# EAGLE design Soil Moisture sensor(only soil)modif_usb_oriz (EAGLE 9.6.2)

## Sheet 1 of 2
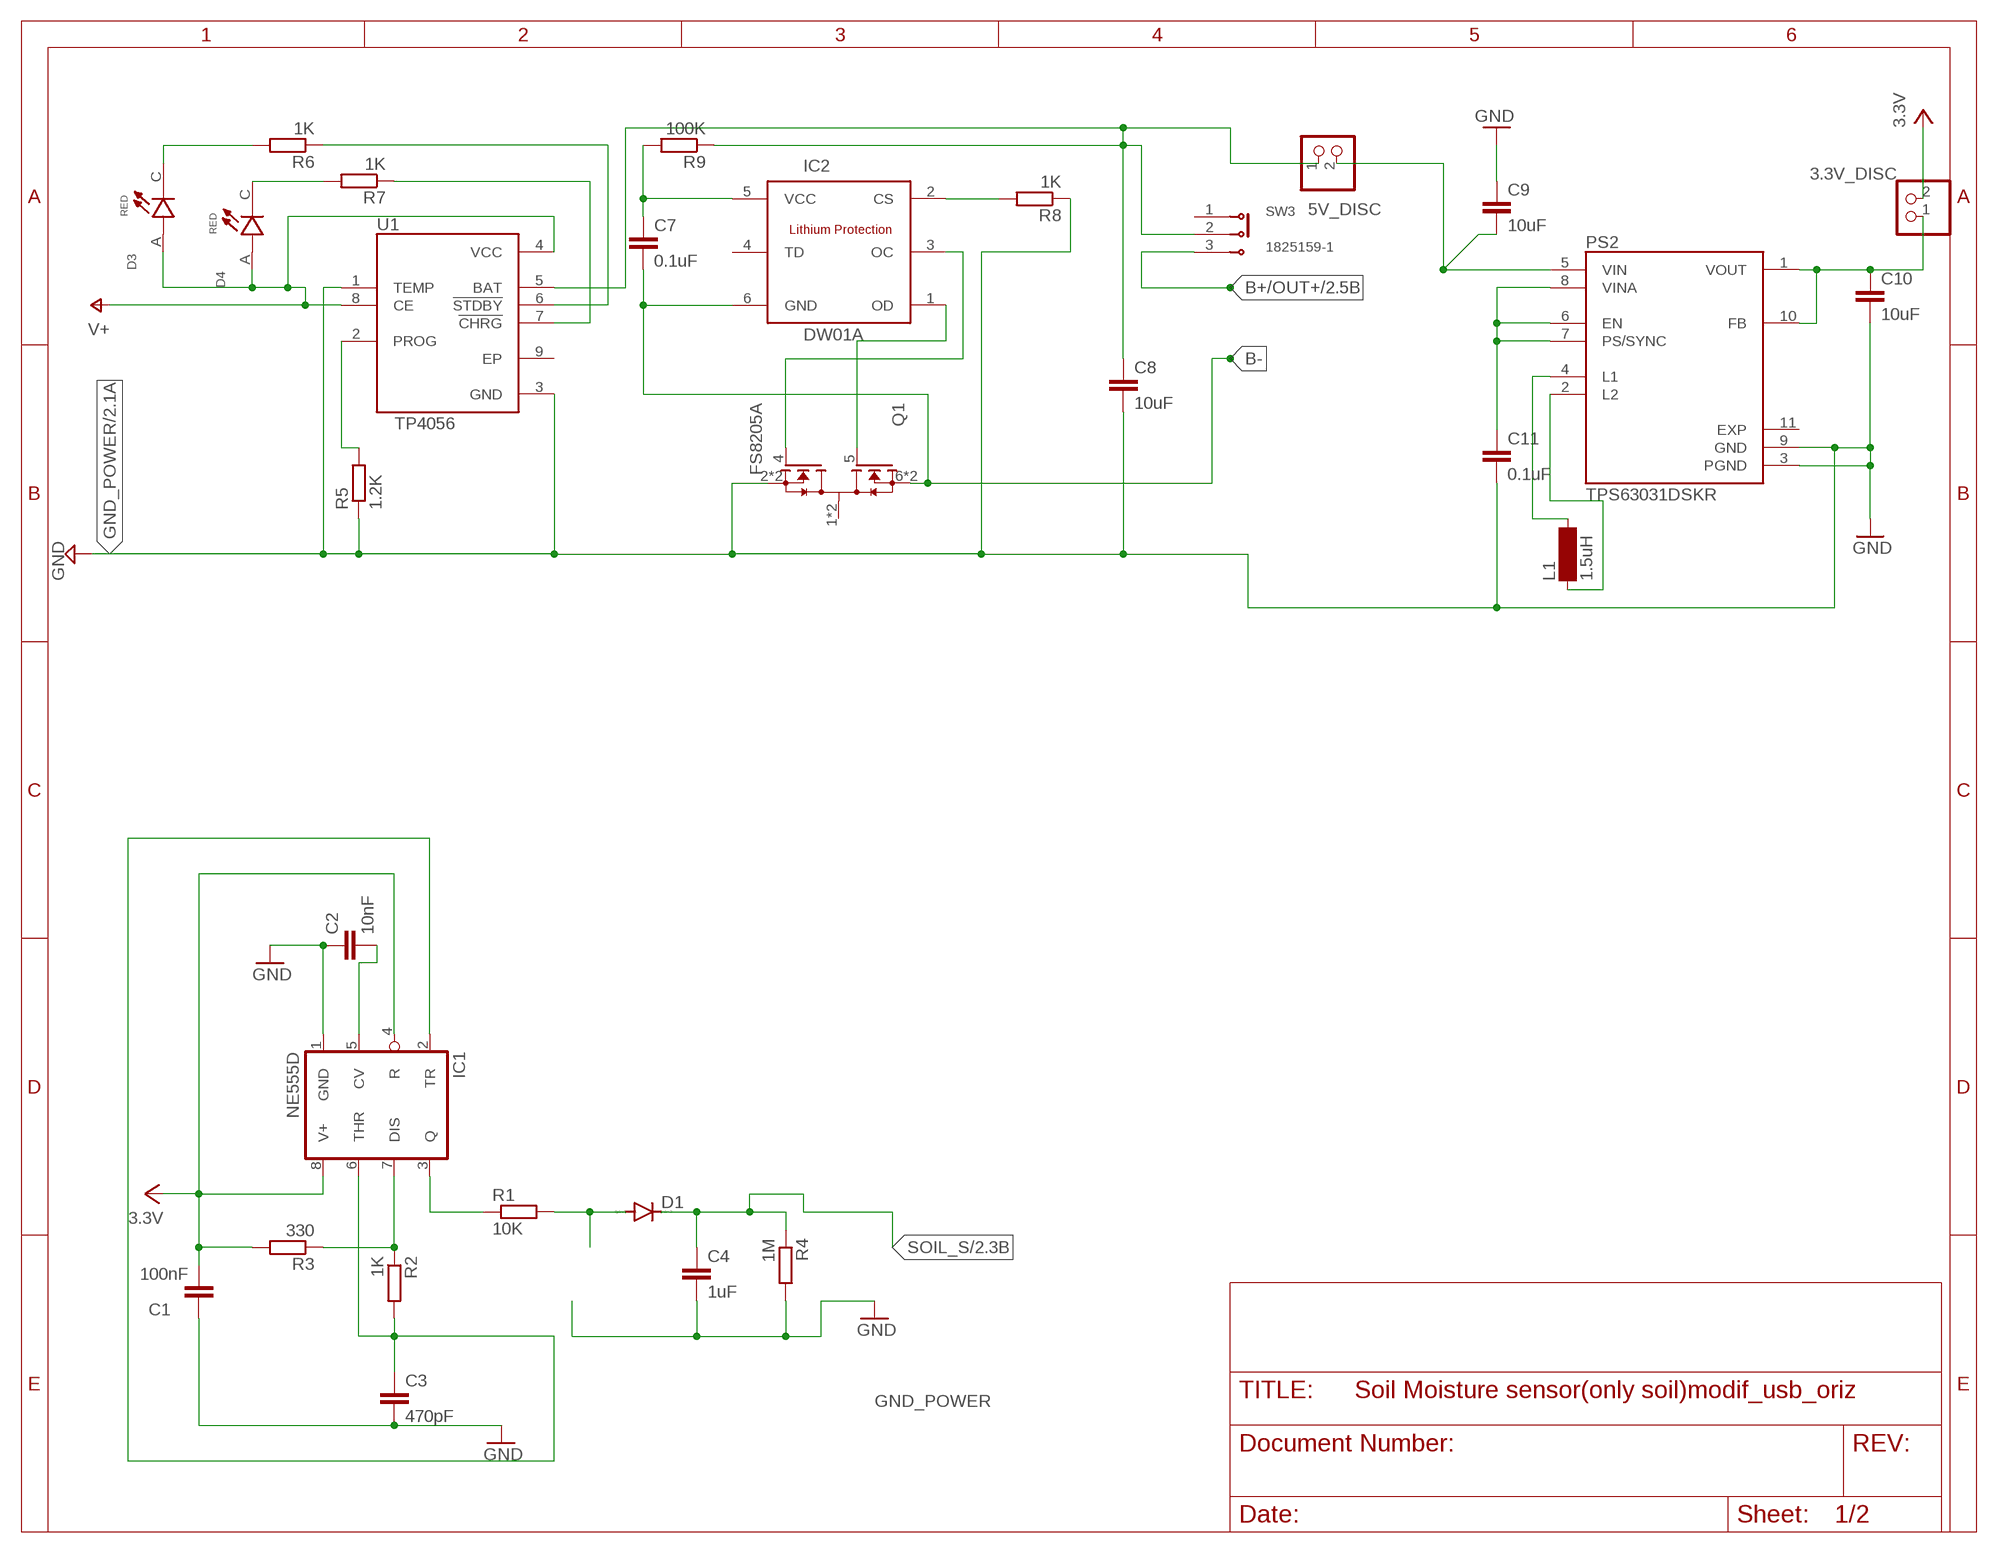
[diagram p0: schematic, sheet 1]

### Parts
3.3V_DISC  PINHD-1X2  [1X02]
5V_DISC  PINHD-1X2  [1X02]
C1  100nF  C-EUC0805  [C0805]
C2  10nF  C-EUC0805  [C0805]
C3  470pF  C-EUC0805  [C0805]
C4  1uF  C-EUC0805  [C0805]
C7  0.1uF  C-EUC0805  [C0805]
C8  10uF  C-EUC0805  [C0805]
C9  10uF  C-EUC0805  [C0805]
C10  10uF  C-EUC0805  [C0805]
C11  0.1uF  C-EUC0805  [C0805]
D1  DIODE-MINIMELF  [MINIMELF]
D3  7012X1  [LED_7012X1]
D4  7012X1  [LED_7012X1]
IC1  NE555D  [SO08]
IC2  DW01A  [SOT23-6]
L1  1.5uH  MS50  [MS50]
PS2  TPS63031DSKR  [SON50P250X250X80-11N]
Q1  FS8205A  [SOP65P640X120-8N]
R1  10K  R-EU_R0805  [R0805]
R2  1K  R-EU_R0805  [R0805]
R3  330  R-EU_R0805  [R0805]
R4  1M  R-EU_R0805  [R0805]
R5  1.2K  R-EU_R0805  [R0805]
R6  1K  R-EU_R0805  [R0805]
R7  1K  R-EU_R0805  [R0805]
R8  1K  R-EU_R0805  [R0805]
R9  100K  R-EU_R0805  [R0805]
SW3  1825159-1  [SW_1825159-1]
U1  TP4056  [SOP127P600X175-9N]

### Nets
B+/OUT+: 5V_DISC.1 C8.1 R9.1 SW3.2 SW3.3 U1.5(BAT) ; also sheet 2
B-: C7.2 IC2.6(GND) Q1.6(S2) Q1.7(S2)
GND_POWER: C1.1 C2.1 C3.2 C4.2 C8.2 C9.1 C10.2 C11.2 IC1.1(GND) PS2.3(PGND) PS2.9(GND) Q1.2(S1) Q1.3(S1) R4.2 R5.1 R8.1 U1.1(TEMP) U1.3(GND) ; supply symbol labelled GND ; also sheet 2
N$1: IC1.7(DIS) R2.1 R3.1
N$2: C2.2 IC1.5(CV)
N$3: C3.1 IC1.2(TR) IC1.6(THR) R2.2
N$4: IC1.3(Q) R1.1
N$5: R7.1 U1.7(!CHRG)
N$6: R6.1 U1.6(!STDBY)
N$7: R5.2 U1.2(PROG)
N$8: D3.C R6.2
N$9: D4.C R7.2
N$10: IC2.1(OD) Q1.5(G2)
N$11: IC2.3(OC) Q1.4(G1)
N$12: IC2.2(CS) R8.2
N$13: C7.1 IC2.5(VCC) R9.2
N$15: C11.1 PS2.6(EN) PS2.7(PS/SYNC) PS2.8(VINA)
N$17: L1.1 PS2.2(L2)
N$18: L1.2 PS2.4(L1)
N$26: 5V_DISC.2 C9.2 PS2.5(VIN)
N$34: 3.3V_DISC.1 C10.1 PS2.1(VOUT) PS2.10(FB)
N$35: D1.A R1.2
SOIL_S: C4.1 D1.C R4.1 ; also sheet 2
V+: D3.A D4.A U1.4(VCC) U1.8(CE) ; also sheet 2
VCC: 3.3V_DISC.2 C1.2 IC1.4(R) IC1.8(V+) R3.2 ; supply symbol labelled 3.3V ; also sheet 2
Unconnected: IC2.4(TD) PS2.11(EXP) Q1.1(D12) Q1.8(D12) SW3.1 U1.9(EP)

## Sheet 2 of 2
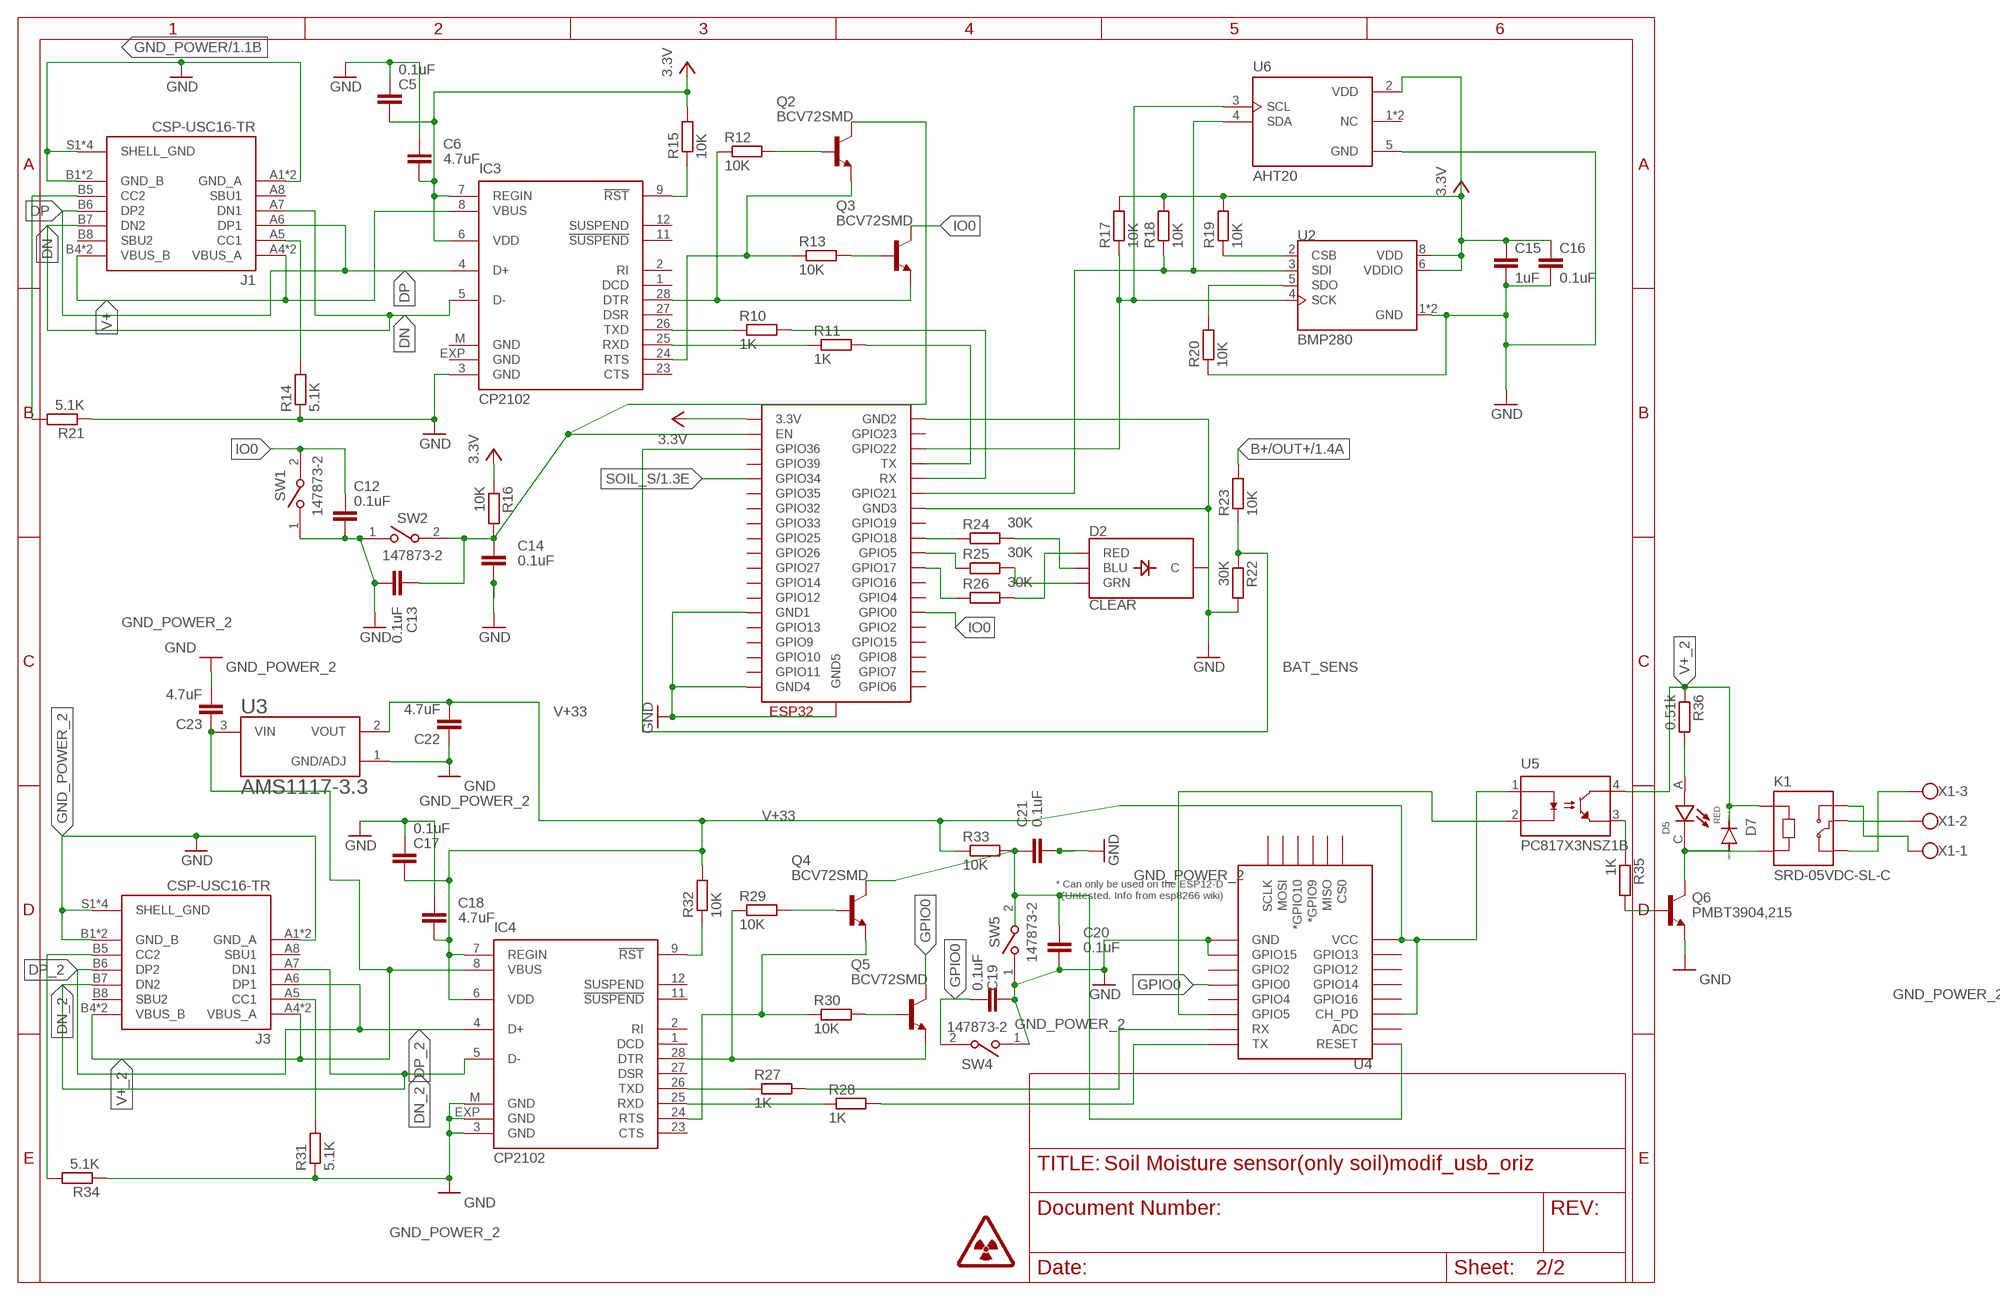
[diagram p1: schematic, sheet 2]

### Parts
C5  0.1uF  C-EUC0805  [C0805]
C6  4.7uF  C-EUC0805  [C0805]
C12  0.1uF  C-EUC0805  [C0805]
C13  0.1uF  C-EUC0805  [C0805]
C14  0.1uF  C-EUC0805  [C0805]
C15  1uF  C-EUC0805  [C0805]
C16  0.1uF  C-EUC0805  [C0805]
C17  0.1uF  C-EUC0805  [C0805]
C18  4.7uF  C-EUC0805  [C0805]
C19  0.1uF  C-EUC0805  [C0805]
C20  0.1uF  C-EUC0805  [C0805]
C21  0.1uF  C-EUC0805  [C0805]
C22  4.7uF  C-EUC0805  [C0805]
C23  4.7uF  C-EUC0805  [C0805]
D2  CLEAR  LED-RGB-CCCLEAR  [LED-RGB-THRU]
D5  7012X1  [LED_7012X1]
D7  DIODE-MINIMELF  [MINIMELF]
IC3  CP2102  [MLP28]
IC4  CP2102  [MLP28]
J1  CSP-USC16-TR  [VALCON_CSP-USC16-TR]
J3  CSP-USC16-TR  [VALCON_CSP-USC16-TR]
K1  SRD-05VDC-SL-C  [RELAY_SRD-05VDC-SL-C]
Q2  BCV72SMD  [SOT23-BEC]
Q3  BCV72SMD  [SOT23-BEC]
Q4  BCV72SMD  [SOT23-BEC]
Q5  BCV72SMD  [SOT23-BEC]
Q6  PMBT3904,215  [TRANS_PMBT3904,215]
R10  1K  R-EU_R0805  [R0805]
R11  1K  R-EU_R0805  [R0805]
R12  10K  R-EU_R0805  [R0805]
R13  10K  R-EU_R0805  [R0805]
R14  5.1K  R-EU_R0805  [R0805]
R15  10K  R-EU_R0805  [R0805]
R16  10K  R-EU_R0805  [R0805]
R17  10K  R-EU_R0805  [R0805]
R18  10K  R-EU_R0805  [R0805]
R19  10K  R-EU_R0805  [R0805]
R20  10K  R-EU_R0805  [R0805]
R21  5.1K  R-EU_R0805  [R0805]
R22  30K  R-EU_R0805  [R0805]
R23  10K  R-EU_R0805  [R0805]
R24  30K  R-EU_R0805  [R0805]
R25  30K  R-EU_R0805  [R0805]
R26  30K  R-EU_R0805  [R0805]
R27  1K  R-EU_R0805  [R0805]
R28  1K  R-EU_R0805  [R0805]
R29  10K  R-EU_R0805  [R0805]
R30  10K  R-EU_R0805  [R0805]
R31  5.1K  R-EU_R0805  [R0805]
R32  10K  R-EU_R0805  [R0805]
R33  10K  R-EU_R0805  [R0805]
R34  5.1K  R-EU_R0805  [R0805]
R35  1K  R-EU_R0805  [R0805]
R36  0.51k  R-EU_R0805  [R0805]
SW1  147873-2  [SW_147873-2]
SW2  147873-2  [SW_147873-2]
SW4  147873-2  [SW_147873-2]
SW5  147873-2  [SW_147873-2]
U2  BMP280  [XDCR_BMP280]
U3  AMS1117-3.3  [SOT229P700X180-4N]
U4  ESP12ESMD  [ESP12E-SMD]
U5  PC817X3NSZ1B  [DIP762W50P254L495H455Q4]
U6  AHT20  [PSON100P300X300X110-6N]
U$1  ESP32-WROOM  [ESP32-WROOM]
X1  W237-103  [W237-103]

### Nets
B+/OUT+: R23.2 ; also sheet 1
BAT_SENS: R22.1 R23.1 U$1.SENSOR_VP(GPIO36)
DN: IC3.5(D-) J1.A7(DN1) J1.B7(DN2)
DN_2: IC4.5(D-) J3.A7(DN1) J3.B7(DN2)
DP: IC3.4(D+) J1.A6(DP1) J1.B6(DP2)
DP_2: IC4.4(D+) J3.A6(DP1) J3.B6(DP2)
GND_POWER: C5.1 C6.1 C12.2 C13.2 C14.2 C15.2 C16.2 D2.2(C) IC3.3(GND) J1.A1(GND_A) J1.A12(GND_A) J1.B1(GND_B) J1.B12(GND_B) J1.S1(SHELL_GND) J1.S2(SHELL_GND) J1.S3(SHELL_GND) J1.S4(SHELL_GND) R14.1 R20.1 R21.1 R22.2 SW1.1 SW2.1 U2.1(GND) U2.7(GND) U6.5(GND) U$1.GND1 U$1.GND2 U$1.GND3 U$1.GND4 U$1.GND5 ; supply symbol labelled GND ; also sheet 1
GND_POWER_2: C17.1 C18.1 C19.2 C20.2 C21.2 C22.1 C23.2 IC4.3(GND) IC4.EXP(GND) IC4.M(GND) J3.A1(GND_A) J3.A12(GND_A) J3.B1(GND_B) J3.B12(GND_B) J3.S1(SHELL_GND) J3.S2(SHELL_GND) J3.S3(SHELL_GND) J3.S4(SHELL_GND) Q6.2(E) R31.1 R34.1 SW4.1 SW5.1 U3.1(GND/ADJ) U4.GND U4.GPIO15 ; supply symbol labelled GND
GPIO0: C19.1 Q5.C SW4.2 U4.GPIO0
IO0: C12.1 Q3.C SW1.2 U$1.IO0(GPIO0)
N$14: IC3.26(TXD) R10.1
N$16: R10.2 U$1.RX
N$19: IC3.25(RXD) R11.1
N$20: R11.2 U$1.TX
N$21: Q3.B R13.2
N$22: Q2.B R12.2
N$23: IC3.28(DTR) Q3.E R12.1
N$24: IC3.24(RTS) Q2.E R13.1
N$25: J1.A5(CC1) R14.2
N$27: C13.1 C14.1 Q2.C R16.2 SW2.2 U$1.EN
N$28: IC4.26(TXD) R27.1
N$29: R24.1 U$1.IO18(GPIO18)
N$30: IC3.9(!RST) R15.1
N$31: D2.4(BLU) R24.2
N$33: D2.1(RED) R26.2
N$36: J1.B5(CC2) R21.2
N$37: R19.1 U2.2(CSB)
N$38: R18.1 U2.3(SDI) U6.4(SDA) U$1.IO21(GPIO21)
N$39: R17.1 U2.4(SCK) U6.3(SCL) U$1.IO22(GPIO22)
N$40: R20.2 U2.5(SDO)
N$41: R27.2 U4.RXD0(RX)
N$42: IC4.25(RXD) R28.1
N$43: R28.2 U4.TXD0(TX)
N$44: Q5.B R30.2
N$45: R25.1 U$1.IO5(GPIO5)
N$46: R26.1 U$1.IO17(GPIO17)
N$47: D2.3(GRN) R25.2
N$48: Q4.B R29.2
N$49: IC4.28(DTR) Q5.E R29.1
N$50: IC4.24(RTS) Q4.E R30.1
N$51: C20.1 C21.1 Q4.C R33.2 SW5.2 U4.RESET
N$52: J3.A5(CC1) R31.2
N$53: IC4.9(!RST) R32.1
N$54: U4.GPIO5 U5.2(CATHODE)
N$55: J3.B5(CC2) R34.2
N$56: R35.1 U5.3(EMITTER)
N$57: Q6.1(B) R35.2
N$58: D5.C D7.A K1.A2 Q6.3(C)
N$59: K1.NC X1.3
N$60: D5.A R36.2
N$61: K1.COM X1.2
N$62: K1.NO X1.1
SOIL_S: U$1.IO34(GPIO34) ; also sheet 1
V+: IC3.8(VBUS) J1.A4(VBUS_A) J1.A9(VBUS_A) J1.B4(VBUS_B) J1.B9(VBUS_B) ; also sheet 1
V+33: C17.2 C18.2 C22.2 IC4.6(VDD) IC4.7(REGIN) R32.2 R33.1 U3.2(VOUT) U4.CH_PD U4.VCC U5.1(ANODE)
V+_2: C23.1 D7.C IC4.8(VBUS) J3.A4(VBUS_A) J3.A9(VBUS_A) J3.B4(VBUS_B) J3.B9(VBUS_B) K1.A1 R36.1 U3.3(VIN) U5.4(COLLECTOR)
VCC: C5.2 C6.2 C15.1 C16.1 IC3.6(VDD) IC3.7(REGIN) R15.2 R16.1 R17.2 R18.2 R19.2 U2.6(VDDIO) U2.8(VDD) U6.2(VDD) U$1.3V3(3.3V) ; supply symbol labelled 3.3V ; also sheet 1
Unconnected: IC3.1(DCD) IC3.2(RI) IC3.11(!SUSPEND) IC3.12(SUSPEND) IC3.23(CTS) IC3.27(DSR) IC4.1(DCD) IC4.2(RI) IC4.11(!SUSPEND) IC4.12(SUSPEND) IC4.23(CTS) IC4.27(DSR) J1.A8(SBU1) J1.B8(SBU2) J3.A8(SBU1) J3.B8(SBU2) U4.ADC U4.CS0 U4.GPIO2 U4.GPIO4 U4.GPIO9(*GPIO9) U4.GPIO10(*GPIO10) U4.GPIO12 U4.GPIO13 U4.GPIO14 U4.GPIO16 U4.MISO U4.MOSI U4.SCLK U6.1(NC) U6.6(NC) U$1.CLK(GPIO6) U$1.CMD(GPIO11) U$1.IO2(GPIO2) U$1.IO4(GPIO4) U$1.IO12(GPIO12) U$1.IO13(GPIO13) U$1.IO14(GPIO14) U$1.IO15(GPIO15) U$1.IO16(GPIO16) U$1.IO19(GPIO19) U$1.IO23(GPIO23) U$1.IO25(GPIO25) U$1.IO26(GPIO26) U$1.IO27(GPIO27) U$1.IO32(GPIO32) U$1.IO33(GPIO33) U$1.IO35(GPIO35) U$1.SD0(GPIO7) U$1.SD1(GPIO8) U$1.SD2(GPIO9) U$1.SD3(GPIO10) U$1.SENSOR_VN(GPIO39)

## Power pins joined to a net without a drawn wire
GND_POWER: IC3.EXP(GND) IC3.M(GND)

## Library data of the parts
3.3V_DISC 5V_DISC = pinhead:PINHD-1X2: PIN HEADER
C1-C23 = rcl:C-EU: CAPACITOR, European symbol
D1 D7 = diode:DIODE-: DIODE
D2 = SparkFun-LED:LED-RGB-CC: LED-RGB Common Cathode Packages: LED RGB-THRU LED_PIRANHA_5MM SparkFun Products: RGB Diffused Common Cathode- Diffuse <[https://www.sparkfun.com/products/9264]> RGB Diffused Common Cathode - Clear <[https://www.sparkfun.com/products/105]> LED-RGB 5mm Square (Piranha) <[https://www.sparkfun.com/products/11679]>; PROD_ID: DIO-08418
D3-D5 = 7012X1:7012X1: Red LED Indication - Discrete 1.7V 0805 (2012 Metric) Check availability <https://pricing.snapeda.com/parts/7012X1/VCC/view-part?ref=eda>; AVAILABILITY: In Stock; DESCRIPTION: Red - LED Indication - Discrete 1.7V 0805 (2012 Metric); MF: VCC; MP: 7012X1; PACKAGE: 0805 Visual Communications; PRICE: None; PURCHASE-URL: https://pricing.snapeda.com/search/part/7012X1/?ref=eda
IC1 = linear:*555: TIMER
IC2 = DW01A:DW01A: Check availability <https://pricing.snapeda.com/parts/DW01A/Fortune%20Semiconductor/view-part?ref=eda>; AVAILABILITY: Not in stock; DESCRIPTION: One Cell Lithium-ion/Polymer Battery Protection IC; MF: Fortune Semiconductor; MP: DW01A; PACKAGE: SOT-23-6 Fortune Semiconductor; PRICE: None
IC3 IC4 = silabs:CP210*: Single-Chip USB to UART Bridge Source: www.silabs.com .. CP2101.pdf / cp2102.pdf; MF: FARNELL; MPN: CP2102-GM; OC_FARNELL: 9282130; OC_NEWARK: 30K5635
J1 J3 = CSP-USC16-TR:CSP-USC16-TR: Check availability <https://pricing.snapeda.com/parts/CSP-USC16-TR/Valcon/view-part?ref=eda>; AVAILABILITY: In Stock; DESCRIPTION: CSP-USC16-TR Valcon USB Type C Surface Mount PCB Socket; MF: Valcon; MP: CSP-USC16-TR; PACKAGE: None; PRICE: None; PURCHASE-URL: https://pricing.snapeda.com/search/part/CSP-USC16-TR/?ref=eda
K1 = SRD-05VDC-SL-C:SRD-05VDC-SL-C: 5V Trigger Relay Module For Arduino And Raspberry Pi 5V Trigger Relay Module For Arduino And Raspberry Pi Check availability <https://pricing.snapeda.com/parts/SRD-05VDC-SL-C/Songle%20Relay/view-part?ref=eda>; AVAILABILITY: Not in stock; DESCRIPTION: 5V Trigger Relay Module For Arduino And Raspberry Pi 5V Trigger Relay Module For Arduino And Raspberry Pi; MF: Songle Relay; MP: SRD-05VDC-SL-C; PACKAGE: NON STANDARD-5 Songle Relay; PRICE: None
L1 = inductor-neosid:MS50: INDUCTOR SMD power inductor; OC_FARNELL: unknown; OC_NEWARK: unknown
PS2 = TPS63031DSKR:TPS63031DSKR: High Efficient Single Inductor Buck-Boost Converter with 1-A Switches Check availability <https://pricing.snapeda.com/parts/TPS63031DSKR/Texas%20Instruments/view-part?ref=eda>; AVAILABILITY: In Stock; DESCRIPTION: High Efficient Single Inductor Buck-Boost Converter with 1-A Switches; MF: Texas Instruments; MP: TPS63031DSKR; PACKAGE: WSON-10 Texas Instruments; PRICE: None; PURCHASE-URL: https://pricing.snapeda.com/search/part/TPS63031DSKR/?ref=eda
Q1 = FS8205A:FS8205A: N/A Check availability <https://pricing.snapeda.com/parts/FS8205A/Fortune%20Semiconductor/view-part?ref=eda>; AVAILABILITY: Not in stock; MF: Fortune Semiconductor; MP: FS8205A; PACKAGE: Package; PRICE: None
Q2-Q5 = BCV72_:BCV72*: NPN Transistor Check availability <https://pricing.snapeda.com/parts/BCV72/ON%20Semiconductor/view-part?ref=eda>; AVAILABILITY: In Stock; DESCRIPTION: Bipolar (BJT) Transistor NPN 60 V 500 mA - 350 mW Surface Mount SOT-23-3; MF: ON Semiconductor; MP: BCV72; PACKAGE: SOT-23-3 Fairchild Semiconductor; PRICE: None; PURCHASE-URL: https://pricing.snapeda.com/search/part/BCV72/?ref=eda
Q6 = PMBT3904_215:PMBT3904,215: Check availability <https://pricing.snapeda.com/parts/PMBT3904%2C215/Nexperia%20USA%20Inc./view-part?ref=eda>; AVAILABILITY: In Stock; DESCRIPTION: Bipolar (BJT) Transistor NPN 40 V 200 mA 300MHz 250 mW Surface Mount TO-236AB; MF: Nexperia USA Inc.; MP: PMBT3904,215; PACKAGE: SOT23-3 Nexperia USA Inc.; PRICE: None; PURCHASE-URL: https://pricing.snapeda.com/search/part/PMBT3904,215/?ref=eda
R1-R36 = rcl:R-EU_: RESISTOR, European symbol; SPICEPREFIX: R
SW1 SW2 SW4 SW5 = 147873-2:147873-2: SWITCH TACTILE SPST-NO 0.05A 24V Check availability <https://pricing.snapeda.com/parts/147873-2/TE%20Connectivity/view-part?ref=eda>; AVAILABILITY: In Stock; COMMENT: 147873-2; CONFIGURATION_POLE-THROW: Single Pole - Single Throw; CONTACT_CURRENT_RATING: 50 mA; DESCRIPTION: Switch Tactile OFF (ON) SPST Rectangular Button J-Bend 0.05A 24VDC 1.77N SMD T/R; MF: TE Connectivity; MP: 147873-2; PACKAGE: None; PRICE: None; PURCHASE-URL: https://pricing.snapeda.com/search/part/147873-2/?ref=eda
SW3 = 1825159-1:1825159-1: SWITCH SLIDE SPDT 300MA 125V Check availability <https://pricing.snapeda.com/parts/1825159-1/TE%20Connectivity/view-part?ref=eda>; AVAILABILITY: In Stock; COMMENT: 1825159-1; CONFIGURATION_POLE-THROW: Single Pole - Double Throw; CONTACT_CURRENT_RATING: .25 A; DESCRIPTION: Slide Switch SPDT Through Hole; EU_ROHS_COMPLIANCE: Compliant; MF: TE Connectivity; MP: 1825159-1; PACKAGE: None; PRICE: None; PURCHASE-URL: https://pricing.snapeda.com/search/part/1825159-1/?ref=eda; SWITCH_TYPE: Slide
U1 = TP4056:TP4056: Complete single cell Li-Ion battery with a constant current / constant voltage linear charger Check availability <https://pricing.snapeda.com/parts/TP4056/NanJing%20Top%20Power%20ASIC%20Corp./view-part?ref=eda>; AVAILABILITY: Not in stock; DESCRIPTION: Complete single cell Li-Ion battery with a constant current / constant voltage linear charger; MF: NanJing Top Power ASIC Corp.; MP: TP4056; PACKAGE: Package; PRICE: None
U2 = BMP280:BMP280: BMP280 Absolute Barometric Pressure Sensor for Battery Powered Devices 2 x 2.5mm Check availability <https://pricing.snapeda.com/parts/BMP280/Bosch/view-part?ref=eda>; AVAILABILITY: In Stock; DESCRIPTION: Pressure Sensor 4.35PSI ~ 15.95PSI (30kPa ~ 110kPa) Absolute - 16b 8-SMD; MF: Bosch; MP: BMP280; PACKAGE: SMD-8 Bosch Sensortec; PRICE: None; PURCHASE-URL: https://pricing.snapeda.com/search/part/BMP280/?ref=eda
U3 = AMS1117-3.3:AMS1117-3.3: Check availability <https://pricing.snapeda.com/parts/AMS1117-3.3/Advanced%20Monolithic%20Systems/view-part?ref=eda>; AVAILABILITY: Not in stock; DESCRIPTION: Sot223/Pkg 1-Amp 3.3-Volt Low Drop Out Voltage Regulatator; MF: Advanced Monolithic Systems; MP: AMS1117-3.3; PACKAGE: SOT-223 Seeed Technology; PRICE: None
U4 = esp8266modules:ESP12E: ESP12E Module
U5 = PC817X3NSZ1B:PC817X3NSZ1B: Optoisolator Transistor Output 1 Channel 4-DIP Check availability <https://pricing.snapeda.com/parts/PC817X3NSZ1B/SHARP/Socle%20Technology/view-part?ref=eda>; AVAILABILITY: In Stock; DESCRIPTION: Optoisolator Transistor Output - 1 Channel 4-DIP; MF: SHARP/Socle Technology; MP: PC817X3NSZ1B; PACKAGE: DIP-4 SHARP/Socle Technology; PRICE: None; PURCHASE-URL: https://pricing.snapeda.com/search/part/PC817X3NSZ1B/?ref=eda
U6 = AHT20:AHT20: Temperature and Humidity sensor Check availability <https://pricing.snapeda.com/parts/AHT20/Asair/view-part?ref=eda>; AVAILABILITY: Not in stock; DESCRIPTION: Temperature and Humidity sensor; MF: Asair; MP: AHT20; PACKAGE: Package; PRICE: None
U$1 = ESP32:ESP32-WROOM
X1 = con-wago-500:W237-103: WAGO SCREW CLAMP; MPN: 237-103; OC_FARNELL: unknown; OC_NEWARK: 18M7116

## Board
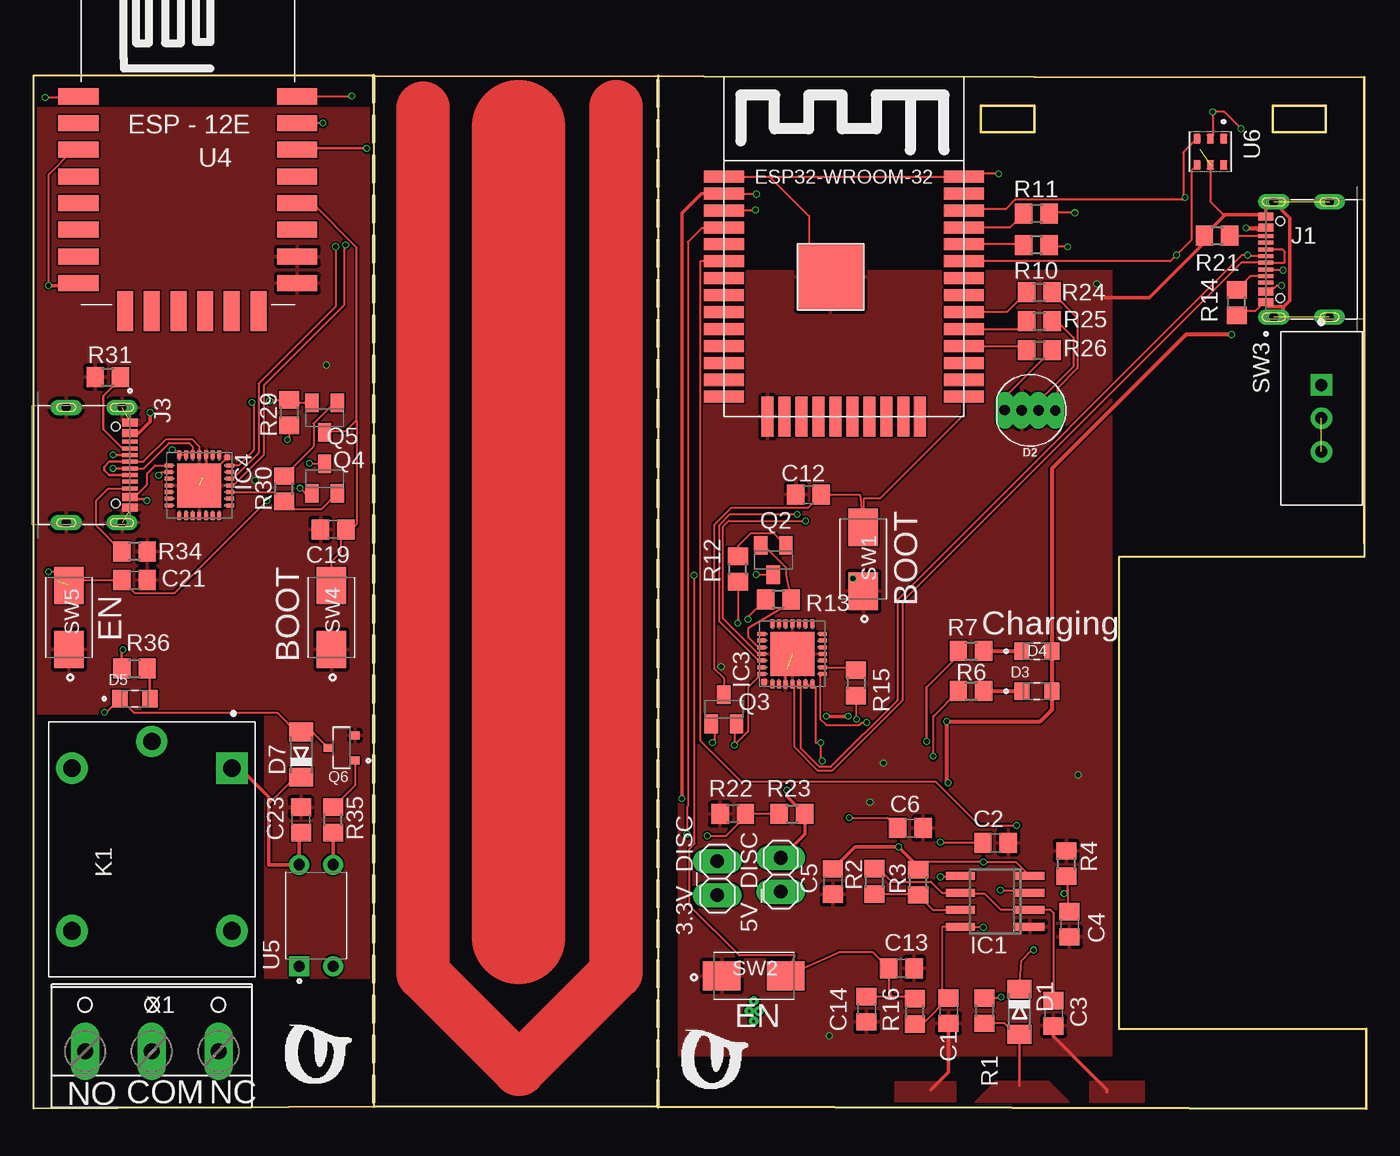
[diagram p2: board, top side]
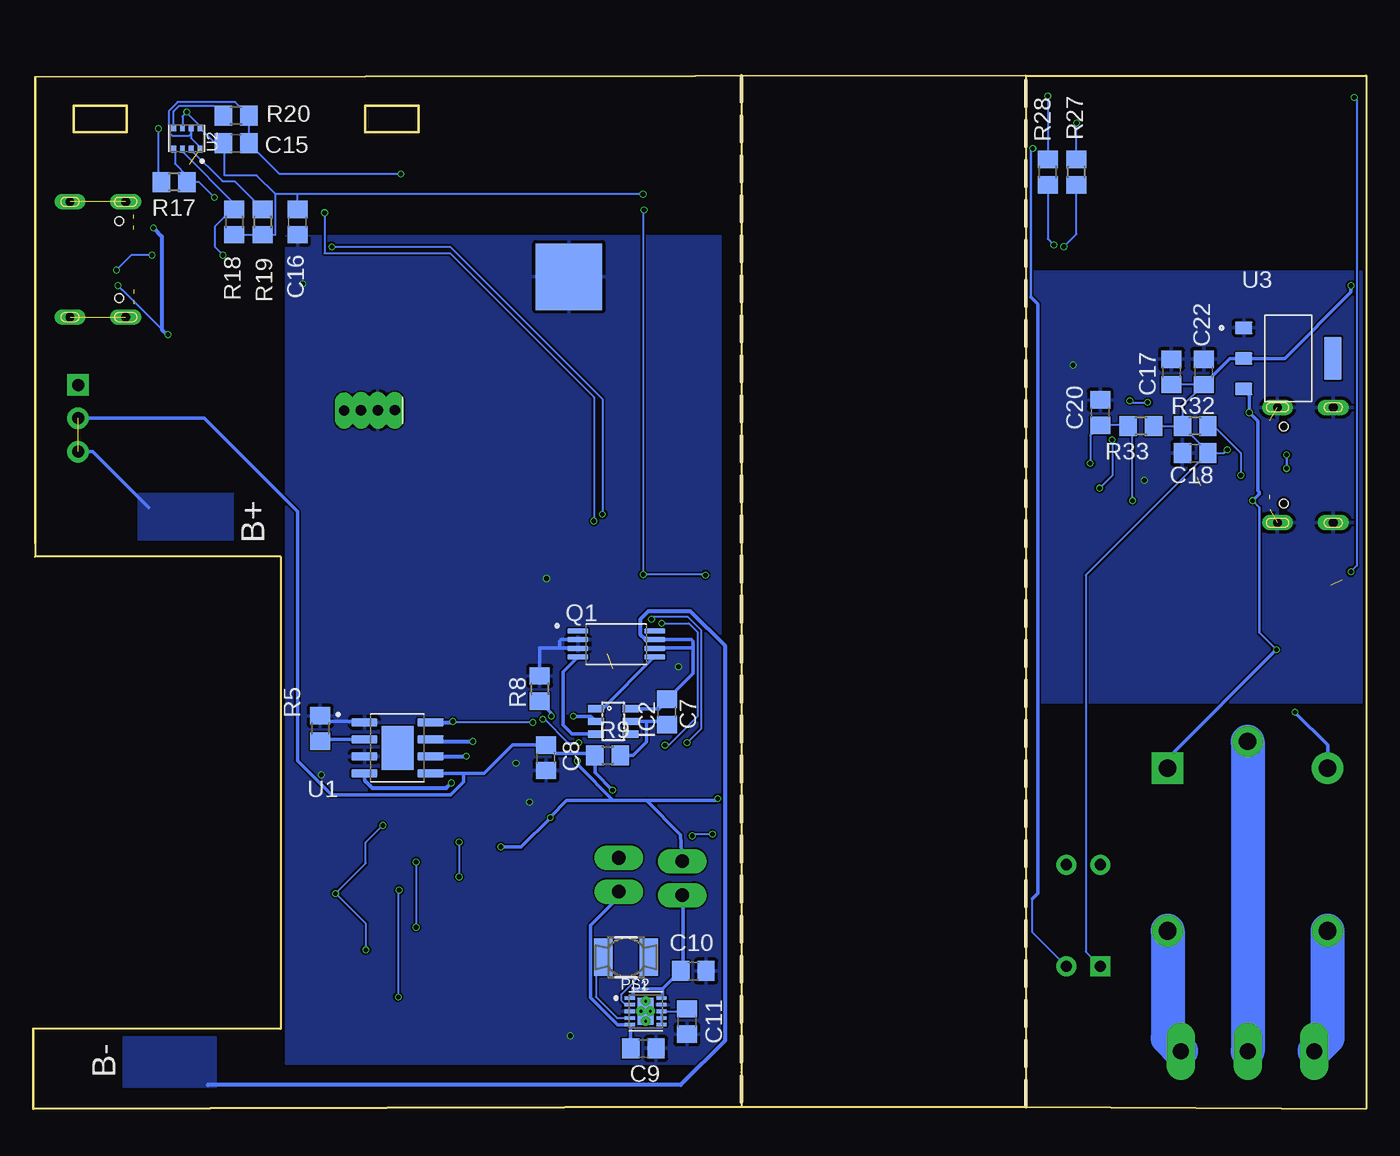
[diagram p3: board, bottom side, seen from below]

Size 99.95 x 77.47 mm. Coordinates in mm from the lower left corner, seen from the top.
Outline: 46.86,0.13 99.95,0 99.95,5.97 81.41,5.97 81.41,41.4 99.82,41.4 99.82,42.42 99.82,77.34 25.53,77.47
Outline: 46.86,77.47 46.86,8.13
Outline: 46.86,8.13 46.86,0.13
Outline: 46.86,8.13 46.86,0.13
Outline: 25.53,77.47 0,77.47 0,0 25.53,0.13
Outline: 46.86,0.13 25.53,0.13
Outline: 25.53,77.47 25.53,0.13
Outline: 71.06,75.21 75.06,75.21 75.06,73.21 71.06,73.21 71.06,75.21
Outline: 92.93,75.22 96.93,75.22 96.93,73.22 92.93,73.22 92.93,75.22
Copper layers (1*16): Top 0.035mm / dielectric 1.6mm / Bottom 0.035mm
Design rules "jlcpcb-2layers": minimum track width 5mil, minimum drill 0.3mm, track to track 5mil, track to pad 5mil, pad to pad 5mil, via to via 5mil, smd to smd 5mil, copper to edge 0.2mm, drill to drill 6mil, minimum pad ring 10mil, minimum via ring 3mil, stop-mask expansion 4mil, vias tented up to drill 0mil, thermal gap 10mil

### Footprints (pad centres in the part's own frame; a part is rotated, then mirrored left to right if it is on the bottom)
1X02 = drill 1.016 long: 1 -1.27,0; 2 1.27,0
C0805 = smd 1.3 x 1.5: 1 -0.95,0; 2 0.95,0
MINIMELF = smd 1.4 x 1.8: A 1.7,0; C -1.7,0
LED-RGB-THRU = drill 0.762 pad 0.889 long: 1 1.905,0; 2 0.635,0; 3 -0.635,0; 4 -1.905,0
LED_7012X1 = smd 1.15 x 1.3: A 1.125,0; C -1.125,0
SO08 = smd 0.6 x 2.2: 1 -1.905,-2.6; 2 -0.635,-2.6; 3 0.635,-2.6; 4 1.905,-2.6; 5 1.905,2.6; 6 0.635,2.6; 7 -0.635,2.6; 8 -1.905,2.6
SOT23-6 = smd 0.55 x 1.2: 1 -0.95,-1.3; 2 0,-1.3; 3 0.95,-1.3; 4 0.95,1.3; 5 0,1.3; 6 -0.95,1.3
MLP28 = smd 0.6 x 0.3: 1 -2.3,1.5; 2 -2.3,1; 3 -2.3,0.5; 4 -2.3,0; 5 -2.3,-0.5; 6 -2.3,-1; 7 -2.3,-1.5; 15 2.3,-1.5; 16 2.3,-1; 17 2.3,-0.5; 18 2.3,0; 19 2.3,0.5; 20 2.3,1; 21 2.3,1.5 | smd 0.3 x 0.6: 8 -1.5,-2.3; 9 -1,-2.3; 10 -0.5,-2.3; 11 0,-2.3; 12 0.5,-2.3; 13 1,-2.3; 14 1.5,-2.3; 22 1.5,2.3; 23 1,2.3; 24 0.5,2.3; 25 0,2.3; 26 -0.5,2.3; 27 -1,2.3; 28 -1.5,2.3 | smd 3.3 x 3.3: EXP 0,0 | smd 0.435 x 0.435: M -2.103,2.103
VALCON_CSP-USC16-TR = smd 0.3 x 1.14: A1 -3.35,0; A4 -2.55,0; A5 -1.25,0; A6 -0.25,0; A7 0.25,0; A8 1.25,0; A9 2.55,0; A12 3.35,0; B1 3.05,0; B4 2.25,0; B5 1.75,0; B6 0.75,0; B7 -0.75,0; B8 -1.75,0; B9 -2.25,0; B12 -3.05,0 | drill 0.65 pad 1 long: S1 -4.325,-0.59; S2 4.325,-0.59 | drill 0.65 pad 0.9 long: S3 -4.325,-4.77; S4 4.325,-4.77 | hole 0.65: -2.89,-1.07; 2.89,-1.07
RELAY_SRD-05VDC-SL-C = drill 1.32 square: A1 -6.1,6 | drill 1.32: A2 -6.1,-6; NC 6.1,6; NO 6.1,-6 | drill 1.29: COM -8.1,0
MS50 = smd 2.8 x 1.4: 1 0,-1.7; 2 0,1.7
SON50P250X250X80-11N = smd 0.84 x 0.27: 1 -1.195,1; 2 -1.195,0.5; 3 -1.195,0; 4 -1.195,-0.5; 5 -1.195,-1; 6 1.195,-1; 7 1.195,-0.5; 8 1.195,0; 9 1.195,0.5; 10 1.195,1 | smd 1.2 x 2: 11 0,0 | drill 0.2 pad 0.3: 12 0.35,0; 13 -0.35,0; 14 0,0.75; 15 0,-0.75
SOP65P640X120-8N = smd 1.56 x 0.4: 1 -2.88,0.975; 2 -2.88,0.325; 3 -2.88,-0.325; 4 -2.88,-0.975; 5 2.88,-0.975; 6 2.88,-0.325; 7 2.88,0.325; 8 2.88,0.975
SOT23-BEC = smd 1 x 1.4: B -0.95,-1.1; C 0,1.1; E 0.95,-1.1
TRANS_PMBT3904,215 = smd 0.7 x 0.6: 1 -1,0.95; 2 -1,-0.95; 3 1,0
R0805 = smd 1.3 x 1.5: 1 -0.95,0; 2 0.95,0
SW_147873-2 = smd 2.8 x 2.2: 1 -2.4,0; 2 2.4,0
SW_1825159-1 = drill 0.9 square: 1 -2.5,0 | drill 0.9: 2 0,0; 3 2.5,0
SOP127P600X175-9N = smd 1.97 x 0.6: 1 -2.475,1.905; 2 -2.475,0.635; 3 -2.475,-0.635; 4 -2.475,-1.905; 5 2.475,-1.905; 6 2.475,-0.635; 7 2.475,0.635; 8 2.475,1.905 | smd 2.413 x 3.302: 9 0,0
XDCR_BMP280 = smd 0.5 x 0.35: 1 0.8,0.975; 2 0.8,0.325; 3 0.8,-0.325; 4 0.8,-0.975; 5 -0.8,-0.975; 6 -0.8,-0.325; 7 -0.8,0.325; 8 -0.8,0.975
SOT229P700X180-4N = smd 1.31 x 0.93: 1 -3.345,2.29; 2 -3.345,0; 3 -3.345,-2.29 | smd 1.31 x 3.24: 4 3.345,0
ESP12E-SMD = smd 3 x 1.2: ADC -8.3,3.8; CH_PD -8.3,1.8; GND 8.1,-8.2; GPIO0 8.1,-2.2; GPIO2 8.1,-4.2; GPIO4 8.1,-0.2; GPIO5 8.1,1.8; GPIO12 -8.3,-4.2; GPIO13 -8.3,-6.2; GPIO14 -8.3,-2.2; GPIO15 8.1,-6.2; GPIO16 -8.3,-0.2; RESET -8.3,5.8; RXD0 8.1,3.8; TXD0 8.1,5.8; VCC -8.3,-8.2 | smd 1.2 x 3: CS0 -4.8,-10.3; GPIO9 -0.8,-10.3; GPIO10 1.2,-10.3; MISO -2.8,-10.3; MOSI 3.2,-10.3; SCLK 5.2,-10.3
DIP762W50P254L495H455Q4 = drill 0.84 pad 1.26 square: 1 -3.81,1.27 | drill 0.84 pad 1.26: 2 -3.81,-1.27; 3 3.81,-1.27; 4 3.81,1.27
PSON100P300X300X110-6N = smd 0.71 x 0.53: 1 -0.985,1; 2 -0.985,0; 3 -0.985,-1; 4 0.985,-1; 5 0.985,0; 6 0.985,1
ESP32-WROOM = smd 3 x 0.9: 3V3 0,16.74; EN 0,15.47; GND1 0,18.01; GND3 18,18.01; IO0 18,1.5; IO4 18,2.77; IO5 18,6.58; IO12 0,1.5; IO14 0,2.77; IO16 18,4.04; IO17 18,5.31; IO18 18,7.85; IO19 18,9.12; IO21 18,11.66; IO22 18,15.47; IO23 18,16.74; IO25 0,6.58; IO26 0,5.31; IO27 0,4.04; IO32 0,9.12; IO33 0,7.85; IO34 0,11.66; IO35 0,10.39; NC 18,10.39; RX 18,12.93; SENSOR_VN 0,12.93; SENSOR_VP 0,14.2; TX 18,14.2 | smd 0.9 x 3: CLK 9.635,0; CMD 8.365,0; GND2 3.285,0; IO2 14.715,0; IO13 4.555,0; IO15 13.445,0; SD0 10.905,0; SD1 12.175,0; SD2 5.825,0; SD3 7.095,0 | smd 5 x 5: GND4 8,10.5 | smd 5 x 5 bottom: GND5 8,10.5
W237-103 = drill 1.194 long: 1 -5,-1.29; 2 0,-1.29; 3 5,-1.29

### Placement (x,y rotation side)
3.3V_DISC  51.3,17.27 90 top
5V_DISC  56.05,17.53 270 top
C1  68.64,7.34 90 top
C2  72.15,19.93 180 top
C3  76.5,7.14 270 top
C4  77.71,13.83 270 top
C5  59.96,17.03 90 top
C6  65.78,21.04 180 top
C7  52.44,29.74 90 bottom
C8  61.51,26.31 270 bottom
C9  54.2,4.51 180 bottom
C10  50.46,10.32 0 bottom
C11  50.93,6.53 270 bottom
C12  58.13,46.04 180 top
C13  65.1,10.54 0 top
C14  62.49,7.46 270 top
C15  84.74,72.39 0 bottom
C16  80.14,66.48 270 bottom
C17  14.61,55.24 270 bottom
C18  12.83,49.15 0 bottom
C19  22.48,43.43 180 top
C20  19.94,52.2 90 bottom
C21  7.59,39.62 0 top
C22  12.19,55.24 270 bottom
C23  20.07,21.65 90 top
D1  73.95,7.27 270 top
D2  74.75,52.36 179.7 top
D3  75.26,31.31 0 top
D4  75.26,34.31 0 top
D5  7.62,30.73 0 top
D7  20.07,26.54 90 top
IC1  72.12,15.55 90 top
IC2  56.46,29.04 270 bottom
IC3  56.91,34.1 90 top
IC4  12.45,46.74 270 top
J1  92.43,63.68 90 top
J3  7.24,48.26 270 top
K1  8.89,19.43 270 top
L1  55.5,11.35 90 bottom
PS2  54.03,7.3 0 bottom
Q1  56.23,34.84 0 bottom
Q2  55.49,41.14 180 top
Q3  51.78,29.95 0 top
Q4  21.84,47.24 0 top
Q5  21.84,51.82 180 top
Q6  23.11,27.05 180 top
R1  71.31,7.35 270 top
R2  63.06,17.03 90 top
R3  66.35,16.98 90 top
R4  77.45,18.37 90 top
R5  78.44,28.51 270 bottom
R6  70.32,31.31 0 top
R7  70.32,34.31 0 top
R8  61.97,31.49 270 bottom
R9  56.88,26.49 0 bottom
R10  75.22,64.75 180 top
R11  75.22,67.11 180 top
R12  52.83,40.46 90 top
R13  55.87,38.18 180 top
R14  90.23,60.45 90 top
R15  61.7,31.92 270 top
R16  66.09,7.29 90 top
R17  89.39,69.46 180 bottom
R18  84.88,66.48 270 bottom
R19  82.76,66.48 270 bottom
R20  84.74,74.47 180 bottom
R21  88.77,65.47 0 top
R22  52.45,22.1 180 top
R23  56.9,22.1 0 top
R24  75.44,61.21 0 top
R25  75.44,59.05 0 top
R26  75.44,56.9 0 top
R27  21.72,70.23 90 bottom
R28  23.88,70.23 90 bottom
R29  19.18,52.2 270 top
R30  18.8,46.48 90 top
R31  5.59,54.86 0 top
R32  12.83,51.18 180 bottom
R33  16.89,51.18 180 bottom
R34  7.59,41.78 180 top
R35  22.48,21.65 90 top
R36  7.59,33.02 0 top
SW1  62.24,41.2 90 top
SW2  54.03,9.95 0 top
SW3  96.59,51.77 270 top
SW4  22.35,36.83 90 top
SW5  2.67,36.83 90 top
U1  72.64,27.06 0 bottom
U2  88.44,72.75 270 bottom
U3  5.84,56.26 0 bottom
U4  11.68,70.1 0 top
U5  21.21,14.48 90 top
U6  88.27,71.75 270 top
U$1  51.78,51.88 0 top
X1  8.89,5.59 0 top

### Tracks (layer width: path | path; a pad name or v marks a point on that pad's centre or on a via)
B+/OUT+  (via drill 0.35)  (1 unrouted)
  Top 0.254: 5V_DISC.1 57.85,20.6 R23.2 56.52,23.43 v56.52,23.88
  Bottom 0.254: 61.51,26.88 C8.1 | C8.1 60.88,26.63 57.97,26.63 R9.1 57.84,25.2 v56.52,23.88 | C8.1 64.01,27.26 66.13,25.15 67.69,25.15 | U1.5 68.21,25.15 68.2,25.15 67.69,25.15 | SW3.3 95.5,49.27 91.31,45.09 | 67.69,25.15 67.69,24.5 68.67,23.51 77.57,23.51 80.14,26.08 80.14,44.77 87.14,51.77 SW3.2
  pour Bottom: 84.96,46.1 92.08,46.1 92.08,42.67 84.96,42.67
B-
  Bottom 0.254: 50.48,34.54 50.48,32.64 C7.2 52.44,30.59 53.03,29.99 IC2.6 | 50.48,34.54 53.33,34.54 Q1.6 | Q1.7 50.61,35.16 50.48,35.04 50.48,34.54
  Bottom 0.305: Q1.7 53.4,35.21 54.09,35.21 54.41,35.53 54.41,36.72 53.82,37.31 50.69,37.31 48.1,34.72 48.1,5.09 51.42,1.78 86.87,1.78
  pour Bottom: 86.23,5.33 93.22,5.33 93.22,1.65 86.23,1.65
BAT_SENS  (via drill 0.35)
  Top 0.152: R23.1 53.59,22.1 | 53.59,22.1 R22.1 | U$1.SENSOR_VP 51.74,66.04 50.14,66.04 49.08,64.98 49.08,22.68 49.02,22.62 v49.02,20.57 | v50.55,20.45 51.94,20.45 53.59,22.1
  Bottom 0.152: v49.02,20.57 50.42,20.57 v50.55,20.45
DN  (via drill 0.35)
  Top 0.152: J1.A7 91.14,63.93 v91.06,64.01 90.63,64.01 64.78,38.16 64.78,30.61 59.79,25.62 58.97,25.62 57.56,27.02 57.56,31.65 IC3.5 | v93.73,62.88 92.48,62.88 J1.B7
  Bottom 0.152: v91.06,64.01 92.6,64.01 v93.73,62.88
DN_2  (via drill 0.35)
  Top 0.152: J3.A7 8.27,48.01 10.18,49.92 11.68,49.92 11.95,49.65 IC4.5
  Top 0.2: J3.A7 v5.97,48.01 | v5.97,49.02 7.23,49.02 J3.B7
  Bottom 0.2: v5.97,48.01 v5.97,49.02
DP
  Top 0.152: J1.B6 93.69,64.43 93.85,64.26 93.85,63.5 93.78,63.43 J1.A6 90.58,63.43 65.17,38.02 65.17,30.6 59.91,25.34 58.85,25.34 57.06,27.13 57.06,31.65 IC3.4
DP_2
  Top 0.152: J3.A6 8.25,48.51 9.94,50.2 11.9,50.2 12.45,49.65 IC4.4
  Top 0.2: J3.A6 5.68,48.51 5.3,48.13 5.3,47.89 5.68,47.51 J3.B6
GND_POWER  (via drill 0.35)  (6 unrouted)
  Top 0.152: C1.1 69.14,5.89 | C3.2 76.5,5.69 | IC3.3 56.41,32.92 56.52,33.02 | R14.1 90.55,59.82 91.62,59.82 J1.B12 | U$1.GND1 55.2,69.89 | 58.17,63.75 58.17,66.93 55.2,69.89 | 55.2,69.89 69.6,69.89 | 69.6,69.89 U$1.GND3 | v72.39,70.1 69.81,70.1 69.6,69.89 | U6.5 88.27,68.01 89.25,67.03
  Top 0.254: C3.2 76.5,5.43 80.52,1.41 80.52,1.27 | C1.1 68.64,2.73 67.31,1.4 | 80.39,60.83 83.69,60.83 87.82,64.96 R21.1 89.38,67.03 | 93.6,60.14 93.77,60.14 94.23,60.6 94.23,66.79 J1.S2 92.43,67.41 J1.A12 89.38,67.03 | 93.6,60.14 92.62,60.14 J1.A1 | 93.6,60.14 93.73,60.01 93.73,59.31 93.06,59.31 J1.S1 | 89.25,67.03 89.38,67.03
  Top 0.508: C3.2 76.48,6.18
  Bottom 0.152: U2.1 87.47,72.14 88.12,72.79 U2.7 88.12,73.11 88.25,72.97 89.55,72.97 89.8,73.21 89.8,74.81 89.13,75.48 84.81,75.48 R20.1 C15.2 81.5,70.1 v72.39,70.1
  Bottom 0.254: U1.1 75.19,29.04 78.02,29.04 R5.1 | R8.1 61.97,34.54 60.48,34.54 | 60.48,34.54 59.14,34.54 Q1.3 | 60.48,34.54 60.48,35.04 60.36,35.16 Q1.2
  other vias: 63.75,25.91 61.47,39.75 51.56,33.15 78.36,25.02 62.74,22.99 59.69,5.46 79.76,61.85
  pour Bottom: 48.41,65.44 80.98,65.44 80.98,3.37 48.41,3.37
  pour Top: 48.41,62.79 48.41,4.01 80.86,4.01 80.86,62.79
  pour Top: 79.27,2.01 79.27,0.51 83.27,0.51 83.27,2.01
  pour Top: 64.65,2.01 69.15,2.01 69.15,0.51 64.65,0.51
GND_POWER1
  Top 4: 29.23,75.01 29.23,10.15 36.41,2.96 43.68,10.23 43.68,75.14
GND_POWER_2  (via drill 0.35)  (3 unrouted)
  Top 0.152: IC4.3 12.95,48.01 | 12.95,48.01 12.95,47.62 12.7,47.37 | IC4.M 13.72,48.01 12.95,48.01
  other vias: 21.97,55.75 16.64,47.12
  pour Bottom: 0.13,62.74 25.27,62.74 25.27,30.48 0.13,30.48
  pour Top: 25.4,9.78 17.4,9.78 17.4,29.59 0.13,29.59 0.13,75.06 25.4,75.06
GPIO0
  Top 0.152: Q5.C 21.93,50.8 23.43,50.8 24.26,51.62 | SW4.2 22.35,41.02 23.05,41.72 23.05,43.05 C19.1 23.88,43.43 24.26,43.82 24.26,51.62 | 24.26,51.62 24.26,64.58 20.93,67.9 U4.GPIO0
IO0
  Top 0.152: Q3.C 51.78,32.29 51.05,33.02 51.05,43.77 52.31,45.03 58.07,45.03 C12.1 62,46.04 SW1.2 62.3,45.73 63.48,45.73 69.78,52.04 U$1.IO0
N$1
  Top 0.152: IC1.7 69.49,14.88 67.5,14.88 R3.1 66.3,16.08 R2.1
N$2  (via drill 0.35)
  Top 0.152: v68.03,19.98 68.07,19.93 C2.2 | IC1.5 69.44,17.37 v68.03,17.37
  Bottom 0.152: v68.03,19.98 v68.03,17.37
N$3
  Top 0.152: R2.2 63.42,17.98 64.4,17.01 67.31,17.01 68.14,16.18 IC1.6 69.62,16.09 71.36,16.09 72.54,14.91 IC1.2 76.27,14.91 76.5,14.69 C3.1
N$4  (via drill 0.35)
  Top 0.152: v72.58,8.37 72.51,8.3 R1.1 | v72.52,16.38 74.53,16.38 IC1.3
  Bottom 0.152: v72.52,16.38 72.58,16.32 v72.58,8.37
N$5  (via drill 0.35)
  Top 0.203: R7.1 69.37,33.97 66.99,31.59 v66.99,27.55 v66.98,27.54
  Bottom 0.305: U1.7 70.01,27.54 v66.98,27.54
N$6  (via drill 0.35)
  Top 0.152: v67.48,26.42 67.48,27.14 67.49,27.15 67.49,29.42 R6.1
  Bottom 0.305: U1.6 v67.48,26.42
N$7
  Bottom 0.2: 78.32,27.69 R5.2
  Bottom 0.254: U1.2 78.32,27.69
N$8
  Top 0.305: R6.2 D3.C
N$9
  Top 0.305: R7.2 D4.C
N$10
  Bottom 0.254: IC2.1 57.26,29.99 53.39,33.86 Q1.5
N$11
  Bottom 0.254: IC2.3 59.53,28.09 60.23,28.79 60.23,32.74 Q1.4
N$12  (via drill 0.35)
  Top 0.254: v59.45,29.42 v61.11,29.42
  Bottom 0.254: v59.45,29.42 58.14,29.42 IC2.2 | R8.2 61.11,29.68 v61.11,29.42
N$13
  Bottom 0.254: 53.98,29.04 IC2.5 | 53.98,29.04 52.68,29.04 C7.1 | R9.2 54.99,26.49 53.98,27.5 53.98,29.04
N$14  (via drill 0.35)
  Top 0.152: v77.57,64.62 76.3,64.62 R10.1 | IC3.26 54.38,33.6 51.46,36.52 51.46,43.78 52.26,44.58 v57.28,44.58
  Bottom 0.152: v77.57,64.62 68.68,64.62 57.25,53.19 57.25,44.6 v57.28,44.58
N$15
  Bottom 0.152: PS2.8 51.12,7.3 C11.1
  Bottom 0.203: PS2.8 PS2.7 PS2.6
N$16
  Top 0.152: R10.2 74.21,64.81 U$1.RX
N$17
  Bottom 0.152: L1.1 53.8,10.62 55.85,8.57 55.85,8.1 55.55,7.8 PS2.2
N$18
  Bottom 0.152: 57.76,11.35 57.76,8.37 56.19,6.8 PS2.4
  Bottom 0.203: L1.2 57.76,11.35
N$19  (via drill 0.35)
  Top 0.152: v78.11,67.18 76.25,67.18 R11.1 | IC3.25 54.38,34.1 51.74,36.74 51.74,43.66 52.14,44.07 v57.91,44.07
  Bottom 0.152: v78.11,67.18 78.11,64.14 68.71,64.14 57.91,53.34 v57.91,44.07
N$20
  Top 0.152: R11.2 73.25,66.08 U$1.TX
N$21  (via drill 0.35)
  Top 0.152: v50.93,27.43 51.08,27.59 51.08,28.59 Q3.B | R13.2 53.59,36.85 v53.59,36.7
  Bottom 0.152: v50.93,27.43 49.85,28.51 49.85,35.85 50.85,36.85 53.45,36.85 v53.59,36.7
N$22
  Top 0.152: Q2.B 55.53,43.14 53.79,43.14 52.83,42.17 R12.2
N$23  (via drill 0.35)
  Top 0.152: IC3.28 53.6,31.58 53.6,28.27 v52.58,27.25 52.58,28.7 Q3.E | R12.1 v52.83,36.4
  Bottom 0.152: v52.83,36.4 50.79,36.4 50.13,35.73 50.13,29.41 52.29,27.25 v52.58,27.25
N$24
  Top 0.152: Q2.E 54.77,42.24 56.45,40.57 56.45,40.02 R13.1 56.18,37.54 53.6,35.99 53.6,35.37 54.38,34.6 IC3.24
N$25
  Top 0.152: J1.A5 91.26,62.43 R14.2
N$26
  Bottom 0.254: C9.2 55.15,6.22 PS2.5 56.15,6.3 58.16,8.3 58.16,13.73 56.05,15.84 5V_DISC.2
N$27  (via drill 0.35)
  Top 0.152: Q2.C 54.24,40.03 v54.21,40.05 | R16.2 65.71,8.24 65.59,8.37 64.4,8.37 64.15,8.95 C13.1 | C13.1 64.15,8.41 C14.1 | C13.1 62.96,11.73 60.4,11.73 SW2.2 57.1,11.47 52.95,11.47 49.21,15.21 49.21,19.49 49.59,19.88 49.59,39.96 v49.54,40.01 | v54.15,67.4 54.1,67.35 U$1.EN
  Bottom 0.152: v54.15,67.4 54.21,67.34 v54.21,40.05 49.59,40.05 v49.54,40.01
N$28  (via drill 0.35)
  Top 0.152: IC4.26 14.99,47.24 16.89,49.14 16.89,54.36 22.67,60.13 v22.67,64.64
  Bottom 0.152: v22.67,64.64 21.72,65.59 R27.1
N$29
  Top 0.152: R24.1 73.01,59.73 U$1.IO18
N$30
  Top 0.152: IC3.9 61.47,33.1 R15.1
N$31
  Top 0.152: R24.2 78.3,59.3 78.3,55.53 76.78,54 76.78,52.48 D2.4
N$32
  Top 7: 36.4,12.84 36.4,73.64
N$33
  Top 0.152: R26.2 72.84,53.35 D2.1
N$34
  Bottom 0.203: PS2.10 52.75,8.38 | 51.23,10.33 C10.1
  Bottom 0.254: 52.75,8.91 52.75,8.98 C10.1 | 52.75,8.91 52.75,8.38 | PS2.1 54.99,8.54 54.99,8.96 54.97,8.99 52.83,8.99 52.75,8.91 | 3.3V_DISC.1 51.23,15.93 51.23,10.33
N$35
  Top 0.152: D1.A 73.95,5.28 72.84,6.4 R1.2
  Top 0.2: D1.A 73.95,1.71
  pour Top: 72.15,2.01 70.65,0.51 77.65,0.51 76.15,2.01
N$36
  Top 0.152: R21.2 89.76,65.43 J1.B5
N$37
  Bottom 0.152: R19.1 84.86,69.53 85.77,69.53 88.12,71.89 U2.2
N$38  (via drill 0.35)
  Top 0.152: U$1.IO21 85.26,63.54 v85.72,64.01 86.84,65.12 86.84,70.34 U6.4
  Bottom 0.152: v85.72,64.01 86.34,64.62 86.34,66.14 85.05,67.43 R18.1 84.88,67.87 88.77,71.76 U2.3
N$39  (via drill 0.35)
  Top 0.152: U$1.IO22 69.87,67.44 72.91,67.44 73.62,68.14 86.18,68.14 v86.36,68.33 86.23,68.45 86.23,71.71 U6.3
  Bottom 0.152: U2.4 89.33,71.86 89.33,70.86 88.44,69.97 R17.1 87.5,69.46 v86.36,68.33
N$40
  Bottom 0.152: U2.5 89.42,74.8 89.01,75.2 86.42,75.2 R20.2
N$41  (via drill 0.35)
  Top 0.152: v21.72,73.91 21.71,73.9 U4.RXD0
  Bottom 0.152: R27.2 v21.72,73.91
N$42  (via drill 0.35)
  Top 0.152: IC4.25 14.98,46.74 17.27,49.02 17.27,54.23 23.3,60.25 23.3,64.64 v23.42,64.77
  Bottom 0.152: R28.1 23.88,65.22 v23.42,64.77
N$43  (via drill 0.35)
  Top 0.152: v23.88,75.95 23.83,75.9 U4.TXD0
  Bottom 0.152: v23.88,75.95 R28.2
N$44
  Top 0.152: R30.2 21.01,49.65 21.01,51.37 22.56,52.92 Q5.B
N$45
  Top 0.152: R25.1 73.85,58.42 69.83,58.42 U$1.IO5
N$46
  Top 0.152: R26.1 74.23,57.15 69.83,57.15 U$1.IO17
N$47
  Top 0.152: D2.3 75.38,53.03 78,55.65 78,57.82 76.77,59.05 R25.2
N$48  (via drill 0.35)
  Top 0.152: R29.2 19.18,50.29 v19.05,50.16 | v19.99,46.53 20.37,46.14 Q4.B
  Bottom 0.152: v19.05,50.16 19.05,47.47 v19.99,46.53
N$49  (via drill 0.35)
  Top 0.152: Q5.E 19.41,52.92 R29.1 19.12,53.09 v17.73,53.09 | v16.38,52.96 16.51,52.83 16.51,49.37 15.38,48.24 IC4.28
  Bottom 0.152: v17.73,53.09 17.6,52.96 v16.38,52.96
N$50
  Top 0.152: IC4.24 18.09,46.24 R30.1 19.37,44.96 21.61,44.96 Q4.E
N$51  (via drill 0.35)  (1 unrouted)
  Top 0.152: v20.7,48.39 21.8,48.39 Q4.C | 3.17,39.59 6.61,39.59 C21.1 7.6,38.67 10.6,38.67 v17.53,45.59 | 3.17,39.59 2.98,39.59 2.94,39.62 1.78,39.62 | U4.RESET 3.3,75.82 v0.89,75.82 | v1.14,40.26 2.51,40.26 3.17,39.59
  Bottom 0.152: v20.7,48.39 20.7,50.48 C20.1 17.91,51.25 R33.2 17.53,50.87 v17.53,45.59 | v0.89,75.82 0.69,75.62 0.69,40.71 v1.14,40.26
N$52
  Top 0.2: R31.2 6.54,54.72 5.25,53.43 5.25,50.96 6.7,49.51 J3.A5
N$53  (via drill 0.35)
  Top 0.152: v9.4,47.49 9.64,47.74 IC4.9
  Bottom 0.152: R32.1 11.44,51.18 9.4,49.15 v9.4,47.49
N$54  (via drill 0.35)
  Top 0.2: U4.GPIO5 19.91,72.03 24.98,72.03 v25,72.01
  Bottom 0.152: 25.01,15.74 25.01,13.2 U5.2
  Bottom 0.2: 25.14,60.84 25.14,71.87 v25,72.01
  Bottom 0.254: 25.14,60.84 24.63,60.33 24.63,16.12 25.01,15.74
N$55
  Top 0.152: R34.2 4.7,43.73 4.7,45.59 5.62,46.51 J3.B5
N$56
  Top 0.254: R35.1 U5.3
N$57
  Top 0.152: Q6.1 24.11,24.24 R35.2
N$58  (via drill 0.35)
  Top 0.152: Q6.3 20.92,28.24 D7.A 19.72,28.24 18.3,29.66 7.57,29.66 D5.C
  Top 0.2: D5.C 5.48,29.72 v5.33,29.72
  Bottom 0.254: v5.33,29.72 2.89,27.27 K1.A2
N$59
  Bottom 2.54: K1.NC 14.89,5.3 X1.3
N$60
  Top 0.2: R36.2 8.74,32.82 D5.A
N$61
  Bottom 2.54: K1.COM X1.2
N$62
  Bottom 2.54: X1.1 2.89,5.29 K1.NO
SOIL_S  (via drill 0.35)
  Top 0.152: 77.58,16.42 77.58,14.9 C4.1 | v77.29,16.13 77.58,16.42 | 77.58,16.42 77.58,17.37 | v75.01,11.9 74.9,11.9 74.08,11.08 D1.C | U$1.IO34 50.06,63.54 50,63.48 50,27.59 53.05,24.53 67.65,24.53 70.95,21.23 v73.75,21.23
  Top 0.406: 77.58,17.37 77.53,17.42 R4.1
  Bottom 0.152: v73.75,21.23 75.02,19.96 75.02,18.4 v77.29,16.13 75.01,13.85 v75.01,11.9
V+  (via drill 0.35)  (2 unrouted)
  Top 0.152: IC3.8 59,32.38 59,29.23 59.47,28.76 61.93,28.76 62.13,28.96 v62.48,28.96 | J1.A4 92.88,61.58 93.08,61.58 93.23,61.72 v93.6,61.72
  Top 0.305: v68.6,24.43 68.48,24.55 v68.48,29.04 75.52,29.04 76.39,29.91 D3.A D4.A 76.39,48 86.43,58.04 v89.86,58.04 | v90.94,66.04 91.7,66.04 91.82,65.93 J1.B4
  Bottom 0.152: v62.48,28.96 68.48,28.96 | v93.6,61.72 93.27,61.39 93.25,61.39 89.9,58.04 v89.86,58.04
  Bottom 0.2: U1.4 75.12,25.04
  Bottom 0.254: 74.8,24.3 75.03,24.54 75.12,24.62 75.12,25.04
  Bottom 0.305: U1.8 68.48,28.96 v68.48,29.04 | v89.86,58.04 89.92,58.04 90.31,58.42 90.31,65.41 v90.94,66.04 | v68.6,24.43 68.98,24.05 74.54,24.05 75.03,24.54
V+33  (via drill 0.35)
  Top 0.152: v10.41,49.4 10.58,49.4 IC4.7 IC4.6 | v1.14,61.72 1.14,70.05 3,71.9 U4.CH_PD
  Top 0.254: v1.14,61.72 3.2,61.72 U4.VCC 3.71,62.23
  Bottom 0.152: R32.2 13.78,52.71 12.29,54.2 C22.2 C17.2 | R33.1 R32.2 | v10.41,49.4 10.67,49.15 11.74,49.15 | 11.74,49.15 C18.2 21.02,40 21.02,11.75 U5.1 | R32.2 11.74,49.15
  Bottom 0.254: v1.14,61.72 1.14,61.21 6.1,56.26 U3.2 10.23,56.26 12.29,54.2
V+_2  (via drill 0.35)  (1 unrouted)
  Top 0.152: J3.B4 7.75,46.01 8.52,46.78 8.52,47.64 9.12,48.24 IC4.8 | 17.65,22.86 19.64,24.84 D7.C | J3.A4 J3.B9
  Top 0.2: R36.1 6.64,34.33 v6.73,34.42 | J3.A9 8.39,45.71 v8.51,45.59
  Top 0.254: J3.B9 7.37,50.64 7.87,50.64 8.76,51.53 v8.76,52.2 | K1.A1 15.49,25.53 17.65,23.37 17.65,22.86 17.65,18.29 U5.4 19.94,20.58 C23.1
  Bottom 0.2: v8.51,45.59 8,45.09 8,35.69 v6.73,34.42
  Bottom 0.254: U3.3 8.76,53.55 v8.76,52.2 8.13,51.56 8.13,46.35 8,46.23 8,46.1 v8.51,45.59 | v6.73,34.42 14.89,26.26 K1.A1
VCC  (via drill 0.35)
  Top 0.152: R16.1 65.94,6.51 66.86,6.51 C1.2 68.17,8.76 68.17,13.64 69.47,13.64 | IC3.6 IC3.7 58.67,31.54 58.67,27.43 v59.05,27.43 59.03,27.41 59.03,26.2 v59.16,26.07 | IC1.8 69.47,13.64 | v90.57,73.48 89.3,74.75 v88.44,74.75 88.44,72.92 U6.2 | v64.89,19.61 v64.89,19.62 | R3.2 65.92,18.36 66.04,18.48 v71.25,18.48 73.7,18.48 IC1.4 | v71.25,13.59 69.53,13.59 69.47,13.64 | R15.2 61.7,29.25 v61.74,29.21 | v61.18,21.81 64.06,21.81 C6.2 | U$1.3V3 54.19,68.62 v54.23,68.58
  Top 0.254: R3.2 66.35,18.16 v64.89,19.62 61.61,19.62 C5.2 | U$1.3V3 50.11,68.62 48.63,67.14 v48.63,23.25
  Bottom 0.152: 59.07,25.76 59.15,25.84 | R18.2 R19.2 81.79,65.53 81.79,68.58 | U2.6 88.77,74.42 v88.44,74.75 88.44,74.7 87.47,73.72 U2.8 86.31,72.39 C15.1 85.6,72.39 | v71.25,18.48 v71.25,13.59 | v90.57,73.48 90.57,69.69 R17.2 | v61.74,29.21 61.61,29.21 59.83,27.43 v59.05,27.43 | v54.23,68.58 80.14,68.58 | C16.1 80.14,68.58 | 85.6,72.39 85.48,72.39 | 81.79,68.58 83.19,69.98 85.6,69.98 85.6,72.39 | 80.14,68.58 81.79,68.58 | v59.15,26.07 v59.16,26.07
  Bottom 0.254: v64.89,19.62 63.37,19.62 v61.18,21.81 61.18,21.88 59.96,23.1 56.41,23.1 56.43,23.12 | 56.43,23.12 56.47,23.12 59.07,25.72 59.07,25.76 | 56.43,23.12 53.99,23.12 53.98,23.1 | 53.98,23.1 51.42,20.54 3.3V_DISC.2 | v48.63,23.25 48.78,23.1 53.98,23.1 | 59.15,25.84 v59.15,26.07

### Text on the board
tNames: EN | BOOT | Charging | BOOT | EN | NO | COM | NC
bNames: B+ | B-
tStop: V score